# EasyEDA Pro project ProPrj_智能警报器(2)_2025-03-04_22-10-02_2025-04-03.epro, schematic Check

## Sheets
1 模块与接口: Board Name: 检测装置; Create Date: 2025-03-04; Page Name: 模块与接口; Project Name: 智能警报器_2025-03-04_22-10-02; Schematic Name: Check; Update Date: 2025-04-04; Company: 嘉立创EDA; Page Size: A4; Version: V1.0
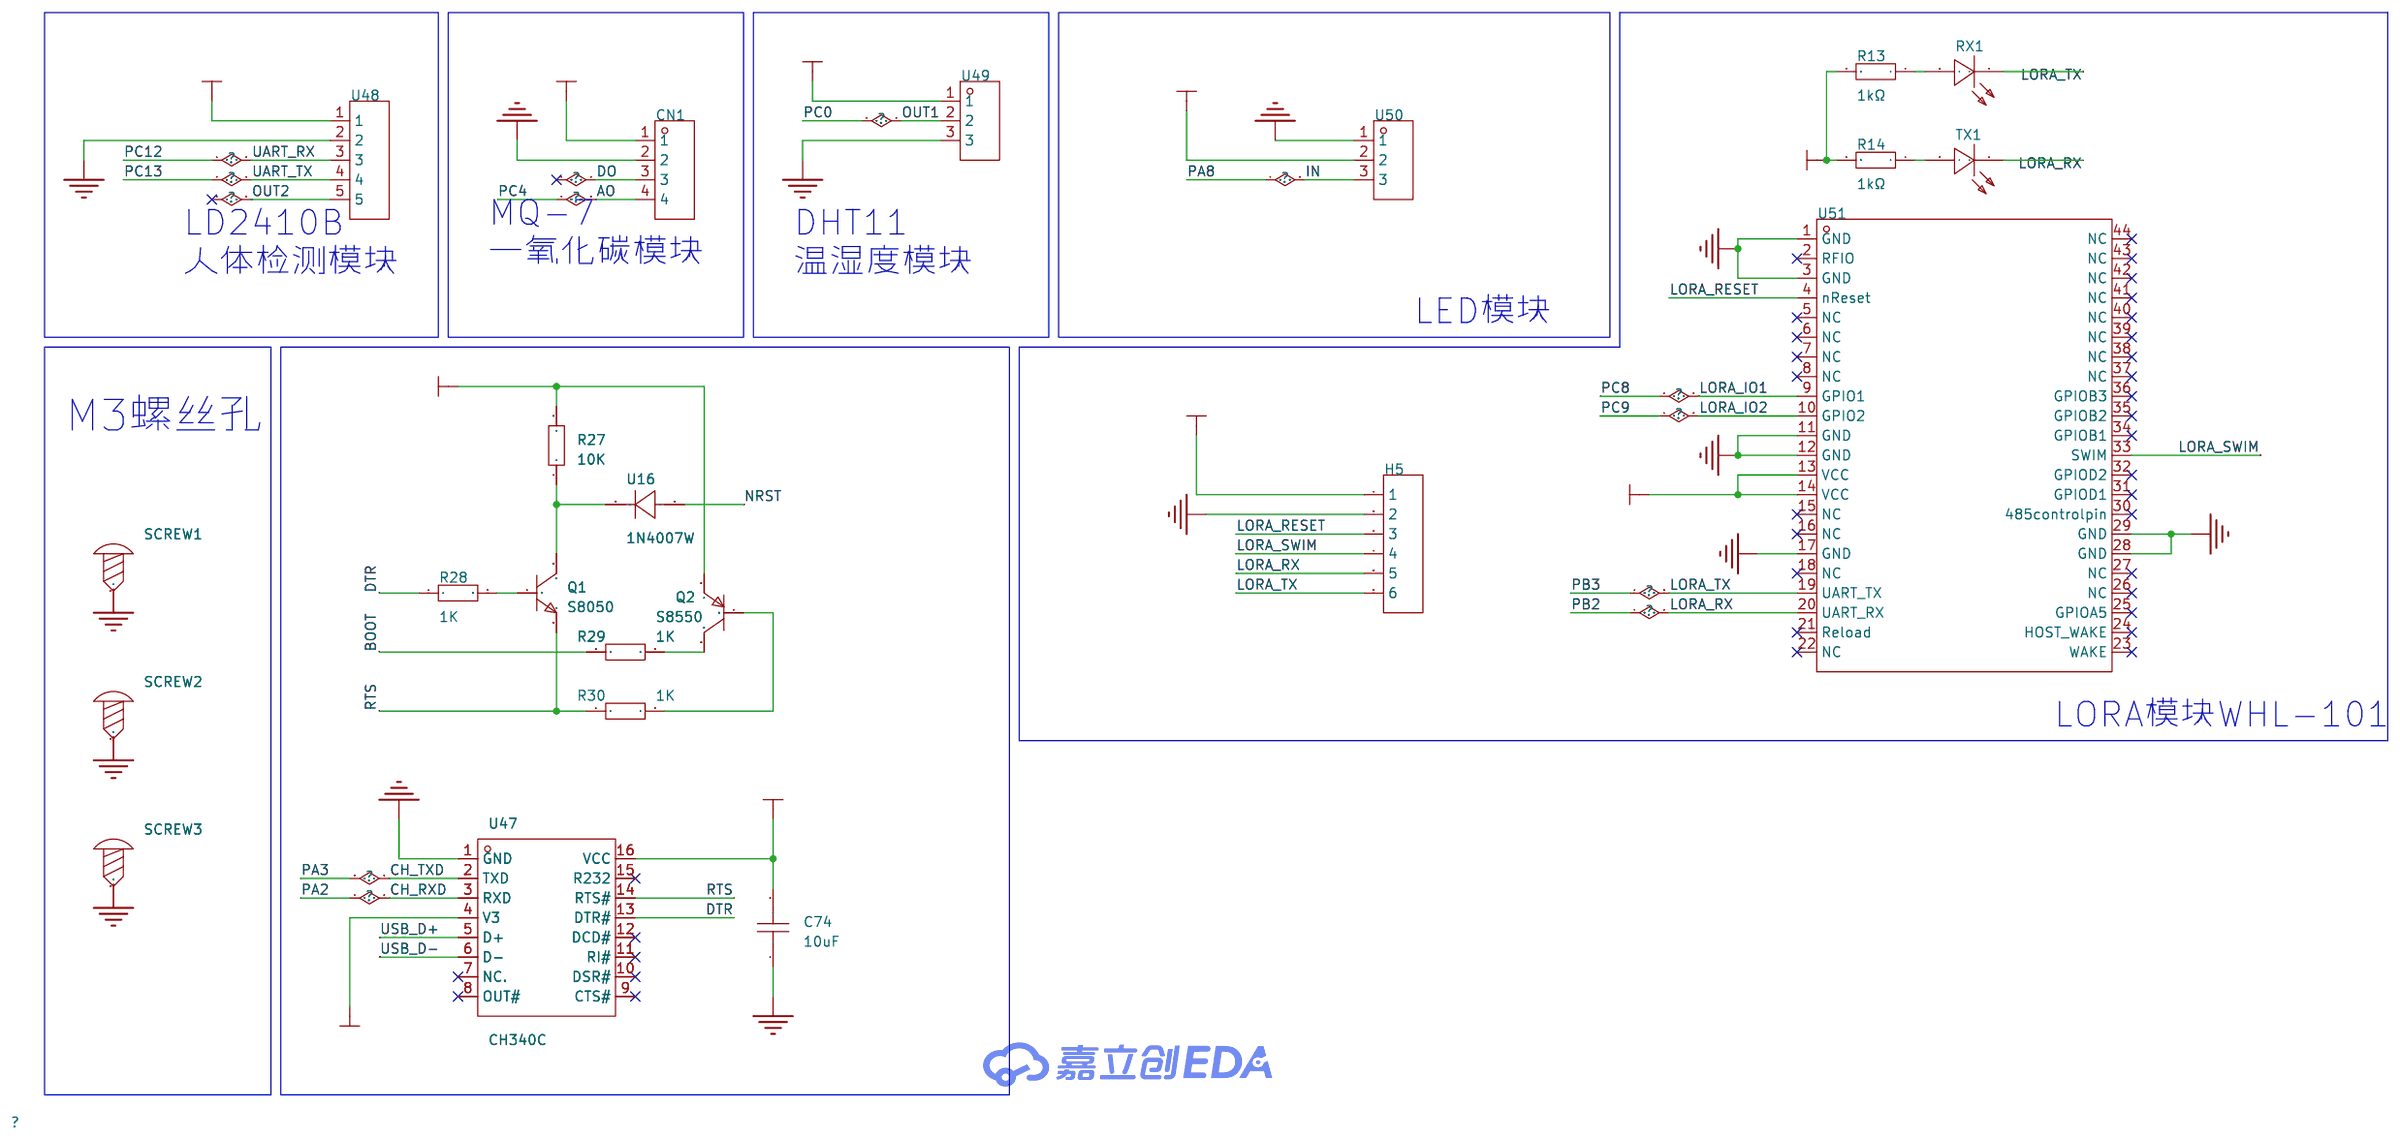
[diagram p6: 模块与接口]
2 电源: Create Date: 2025-03-11; Page Name: 电源; Schematic Name: Schematic1; Update Date: 2025-04-03
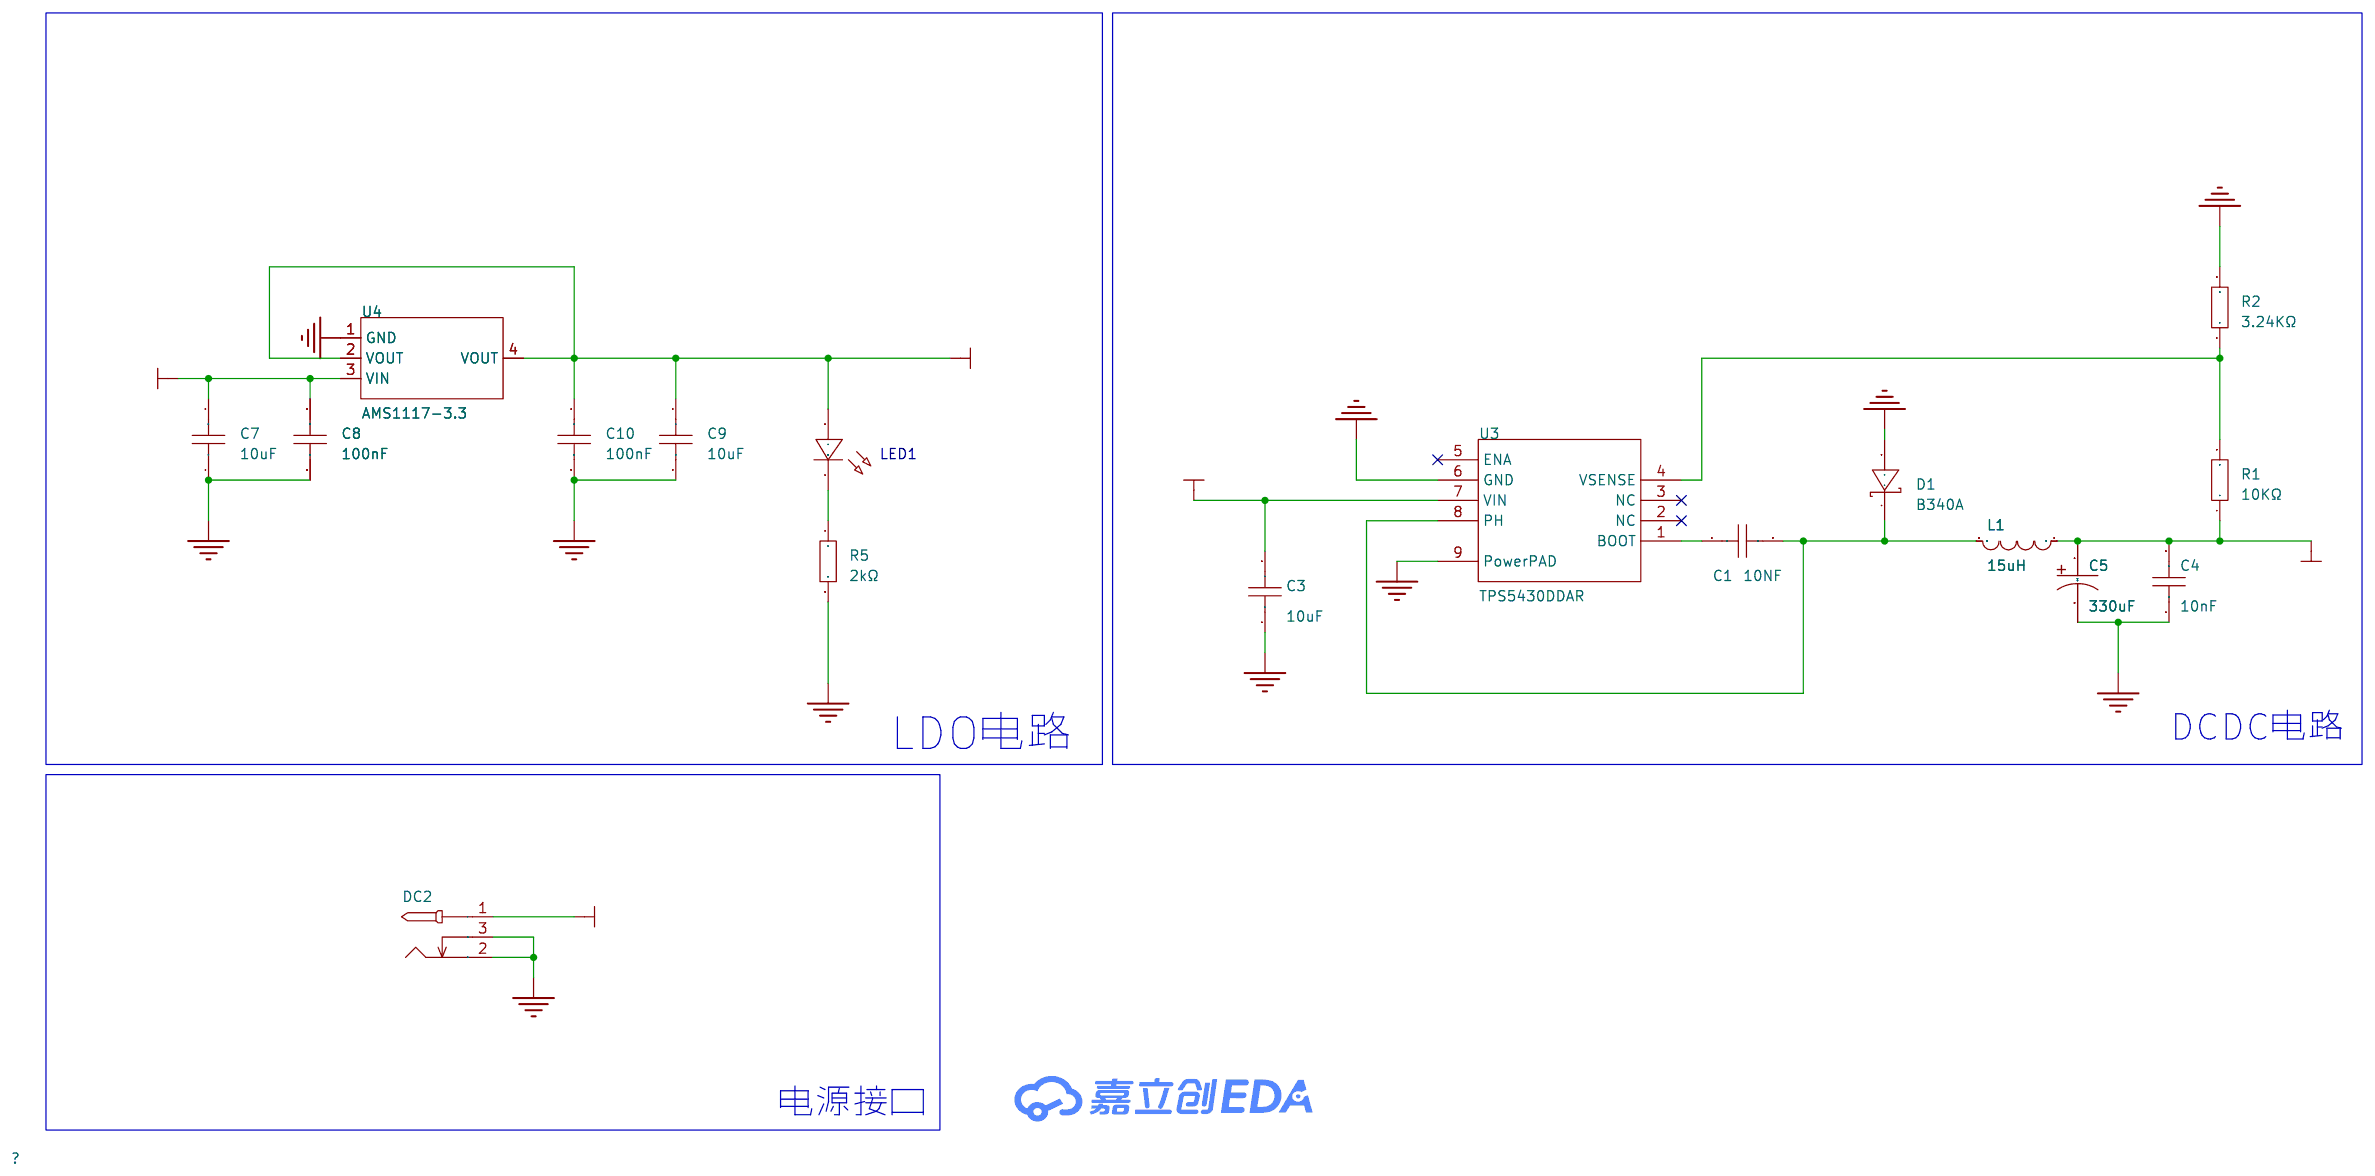
[diagram p7: 电源]
3 主控: Create Date: 2025-03-23; Page Name: 主控
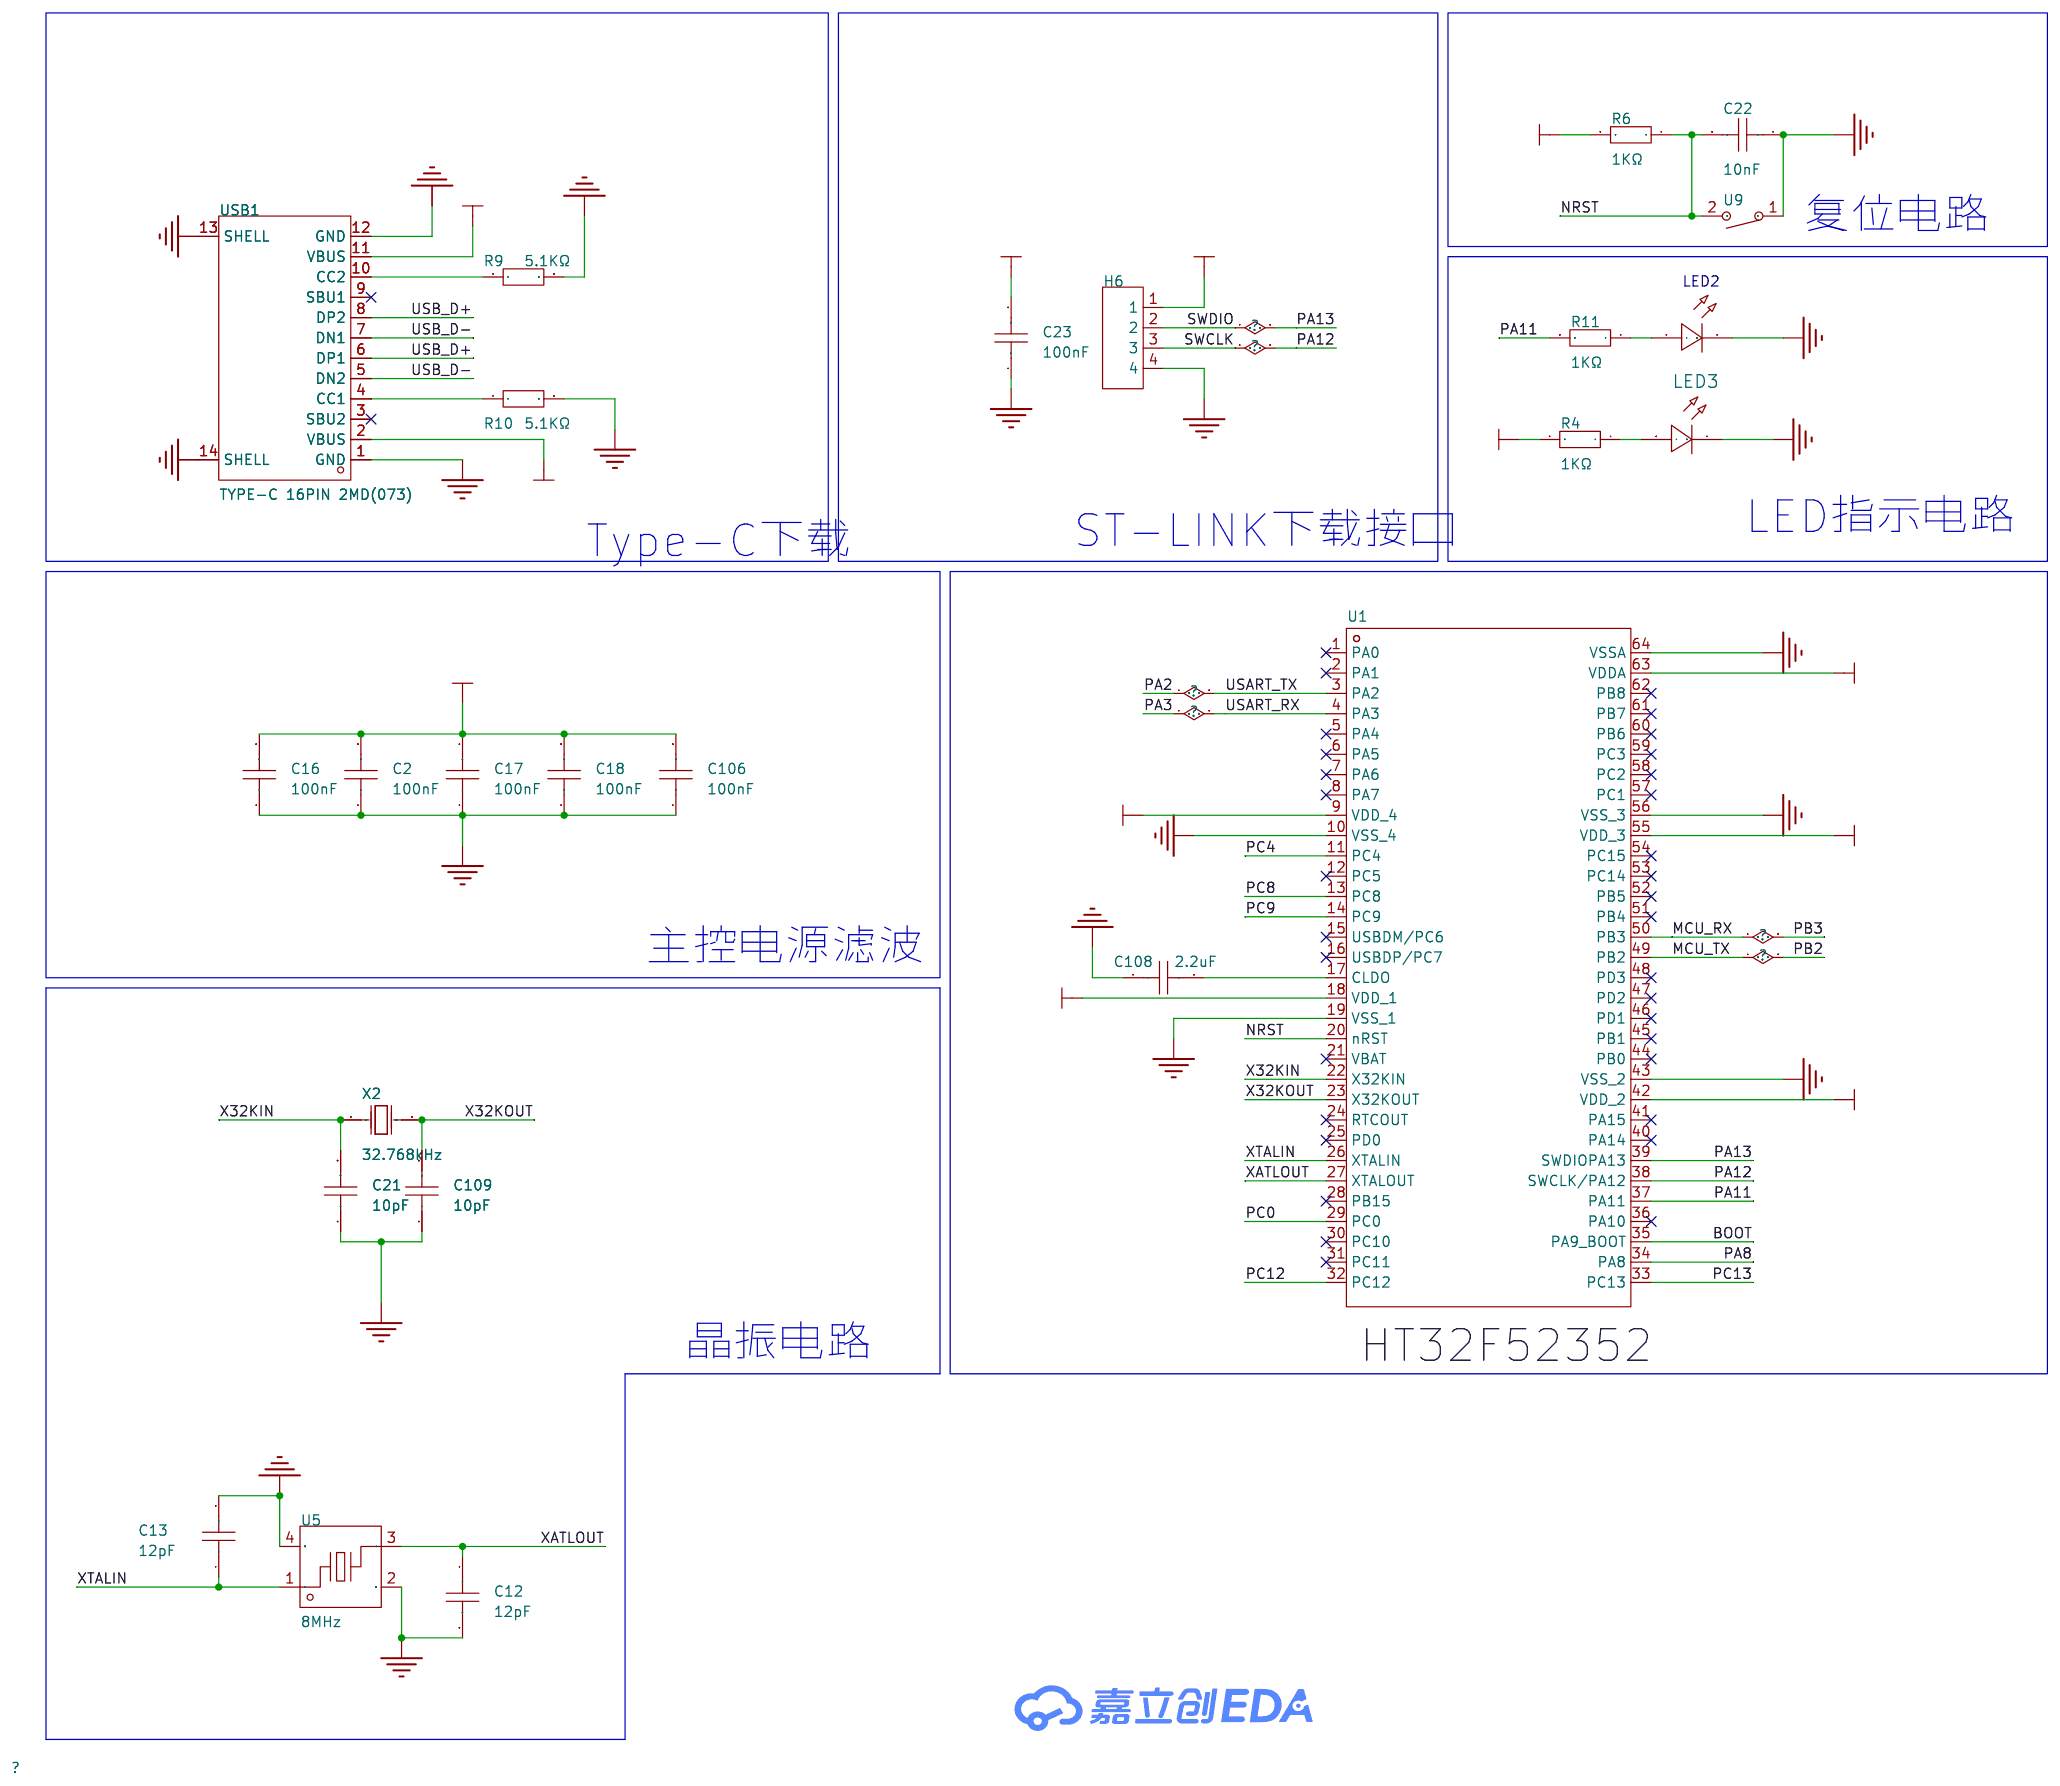
[diagram p8: 主控]

## Parts
sheet 主控
C2  100nF  [C0603]
C12  12pF  [C0603]
C13  12pF  [C0603]
C16  100nF  [C0603]
C17  100nF  [C0603]
C18  100nF  [C0603]
C21  10pF  [C0603]
C22  10nF  [C0603]
C23  100nF  [C0603]
C106  100nF  [C0603]
C108  2.2uF  [C0603]
C109  10pF  [C0603]
H6  -  [HDR-TH_4P-P2.54-V-M]
LED2  -  [LED_0603]
LED3  -  [LED_0603]
R4  1KΩ  [R0603]
R6  1KΩ  [R0603]
R9  5.1KΩ  [R0603]
R10  5.1KΩ  [R0603]
R11  1KΩ  [R0603]
U1  HT32F52352  [LQFP-64_L7.0-W7.0-P0.40-LS9.2-BL]
U5  8MHz  [CRYSTAL-SMD_4P-L2.5-W2.0-BL]
U9  轻触开关/软触开关(无声)/贴片6*6*5  [SW-SMD_L6.0-W5.9-LS6.6]
USB1  TYPE-C 16PIN 2MD(073)  [USB-C-SMD_TYPE-C-6PIN-2MD-073]
X2  32.768kHz  [OSC-SMD_L3.2-W1.5]
sheet 模块与接口
C74  10uF  [C0603]
CN1  WAFER-XH254Z-4A  [CONN-TH_XH-4A]
H5  -  [HDR-TH_6P-P2.54-V-M-1]
Q1  S8050  [SOT-23-3_L2.9-W1.3-P1.90-LS2.4-BR]
Q2  S8550  [SOT-23-3_L2.9-W1.3-P1.90-LS2.4-BR]
R13  1kΩ  [R0603]
R14  1kΩ  [R0603]
R27  10K  [R0603]
R28  1K  [R0603]
R29  1K  [R0603]
R30  1K  [R0603]
RX1  KT-0603R  [LED0603-RD]
SCREW1  -  [M3螺丝]
SCREW2  -  [M3螺丝]
SCREW3  -  [M3螺丝]
TX1  KT-0603R  [LED0603-RD]
U16  1N4007W  [SOD-123FL_L2.7-W1.8-LS3.7-RD]
U47  CH340C  [SOP-16_L10.0-W3.9-P1.27-LS6.0-BL]
U48  WAFER-XH254Z-5A  [CONN-TH_5P-P2.50_WAFER-XH254Z-5A]
U49  WAFER-XH254Z-3A  [CONN-TH_XH-3A]
U50  WAFER-XH254Z-3A  [CONN-TH_XH-3A]
U51  WH-L101-L-C  [COMM-SMD_WH-L101-L-C]
sheet 电源
C1  10NF  [C0603]
C3  10uF  [C0603]
C4  10nF  [C0603]
C5  330uF  [CAP-SMD_BD5.0-L5.3-W5.3-FD]
C7  10uF  [C0603]
C8  100nF  [C0603]
C9  10uF  [C0603]
C10  100nF  [C0603]
D1  B340A  [SMA_L4.3-W2.6-LS5.1-RD]
DC2  -  [DC-005_2.5]
L1  15uH  [L0603]
LED1  -  [LED_0603]
R1  10KΩ  [R0603]
R2  3.24KΩ  [R0603]
R5  2kΩ  [R0603]
U3  TPS5430DDAR  [ESOP-8_L4.9-W3.9-P1.27-LS6.0-TL-EP]
U4  AMS1117-3.3  [SOT-223-3_L6.5-W3.4-P2.30-LS7.0-BR]

## Library data of the parts
C1-C4 C7-C10 C12 C13 C16-C18 C21-C23 C74 C106 C108 C109 = CAP_0603: Supplier Footprint: 0603
H6 = HDR-M_2.54_1x4P: Supplier Part: C492403; Supplier Footprint: 插件; JLCPCB Part Class: 扩展库
LED2 = LED_0603-B: Supplier Footprint: 0603
LED3 = LED_0603-R: Supplier Footprint: 0603
R4 R6 R9-R11 = Res_0201: Supplier Footprint: 0201
U1 = HT32F52352: CPU内核:CM0;程序存储容量:128KB;RAM总容量:16KB;GPIO端口数量:51;工作电压范围:2V~3.6V;CPU最大主频:48MHz;程序存储器类型:FLASH;; Supplier Part: C97188; Manufacturer: HOLTEK(合泰/盛群); Supplier Footprint: LQFP-64(7x7); JLCPCB Part Class: 扩展库; Datasheet: https://atta.szlcsc.com/upload/public/pdf/source/20231226/5DA994CBD2B5E793EB1549DB6E6CD66A.pdf; Supplier: LCSC; CPU Core: CM0; Program Storage Size: 128KB; RAM Size: 16KB; GPIO Ports Number: 51; Operating Voltage Range: 2V~3.6V; CPU Maximum Speed: 48MHz; Program Memory Type: FLASH; Operating Temperature Range: -40℃~+85℃; ADC (Bit): 12bit; 16Bit Timer: 5; 32Bit Timer: 2; UART/USART: 4; I2C: 2; I2S: 1; SPI: 2; Universal Serial Bus: 有; Internal Comparator: 有; Peripheral/Function: 低电压检测；看门狗；CCP捕获/比较；乘法器；IrDA；CRC校验；DMA；RTC实时时钟; Watchdog: 有; Real-Time Clock: 有; Infrared Data Association: 有; Low-Voltage Detect: 有; CCP Capture/Compare: 有; Direct Memory Access: 有; Internal Oscillator: 有
U5 = SX2B50.000F1010F30: 晶振类型:贴片晶振;频率:50MHz;常温频差:±10ppm;外接负载电容:10pF;频率稳定度(全温):±30ppm;; LCSC Part Name: 50MHz ±10ppm 10pF; Supplier Part: C7301998; Manufacturer: SCTF(星通时频); Supplier Footprint: SMD2520-4P; JLCPCB Part Class: 扩展库; Datasheet: https://atta.szlcsc.com/upload/public/pdf/source/20230613/6EDA3BD8336403B8AE72C3A173CC38D7.pdf; Supplier: LCSC; Crystal Type: 贴片晶振; Normal temperature Frequency Tolerance: ±10ppm; External load capacitor: 10pF; Frequency Stability(Full temperature range): ±30ppm; Equivalent Series Resistance (ESR): 40Ω; Operating Temperature: -40℃~+85℃
U9 = 轻触开关/软触开关(无声)/贴片6*6*5_C9900014294: Supplier Part: C9900014294; JLCPCB Part Class: 扩展库; Supplier: LCSC
USB1 = TYPE-C 16PIN 2MD(073): 连接器类型:Type-C;标准:-;公母:母;端口数量:1;触点数量:16P;安装方式:卧贴;额定电流 - 电源:5A;工作温度范围:-25℃~+85℃;; LCSC Part Name: Type-C 母 卧贴; Supplier Part: C2765186; Manufacturer: SHOU HAN(首韩); Supplier Footprint: SMD; Datasheet: https://atta.szlcsc.com/upload/public/pdf/source/20211123/39B17C16241EAC15C5E277BDA434118E.pdf; Supplier: LCSC; Connector Type: Type-C; Gender: 母; Number of Ports: 1; Number of Contacts: 16P; Mounting Style: 卧贴; Current Rating - Power (Max): 5A; Operating Temperature Range: -25℃~+85℃
X2 = SF32WK32768D31T002: 晶振类型:-;频率:-;外接负载电容:-;; LCSC Part Name: 3215  32.768KHZ  12.5PF  ±20PPM  -40℃~+85℃; Supplier Part: C271654; Manufacturer: TKD(泰晶); Supplier Footprint: SMD3215-2P; JLCPCB Part Class: 扩展库; Datasheet: https://atta.szlcsc.com/upload/public/pdf/source/20210414/C271654_9FD726E46D0A9E6DACC0E569C8E3A63B.pdf; Supplier: LCSC
CN1 = WAFER-XH254Z-4A: 插针结构:1x4P;间距:2.54mm;安装方式:直插;参考系列:XH;总PIN数:4P;排数:1;每排PIN数:4;额定电流:3A;工作温度范围:-25℃~+85℃;; Supplier Part: C7432684; Manufacturer: HANBO(汉博); Supplier Footprint: 插件,P=2.5mm; JLCPCB Part Class: 扩展库; Datasheet: https://atta.szlcsc.com/upload/public/pdf/source/20230718/3B4FABA5D38EFB02DAF74E7C2B33D98F.pdf; Supplier: LCSC; Pins Structure: 1x4P; Pitch: 2.54mm; Mounting Style: 直插; Reference Series: XH; Number of Pins: 4P; Number of Rows: 1; Number of PINs Per Row: 4; Current Rating (Max): 3A; Operating Temperature Range: -25℃~+85℃
H5 = HDR-M_2.54_1x6P: Supplier Part: C37208; Supplier Footprint: 插件; JLCPCB Part Class: 扩展库
Q1 = S8050: NPN 25V 500mA 120-400 SOT-23; Supplier Part: C2931719; Manufacturer: Doeshare(德芯); Supplier Footprint: SOT-23; JLCPCB Part Class: 扩展库; Datasheet: https://atta.szlcsc.com/upload/public/pdf/source/20220117/E6D3315E0D6ADDB25840BFFAC039C5C0.pdf; Supplier: LCSC
Q2 = S8550: LCSC Part Name: PNP -25V -500mA 120-400 SOT-23; Supplier Part: C2931720; Manufacturer: Doeshare(德芯); Supplier Footprint: SOT-23; JLCPCB Part Class: 扩展库; Datasheet: https://atta.szlcsc.com/upload/public/pdf/source/20220104/15A23F6542E365B9E2BA018BE45092B6.pdf; Supplier: LCSC
R13 R14 = RC0603FR-071KL: 电阻类型:厚膜电阻;阻值:1kΩ;精度:±1%;功率:100mW;最大工作电压:75V;温度系数:±100ppm/℃;; LCSC Part Name: 厚膜电阻 1kΩ ±1% 100mW; Supplier Part: C22548; Manufacturer: YAGEO(国巨); Supplier Footprint: 0603; JLCPCB Part Class: Extended Part; Datasheet: https://atta.szlcsc.com/upload/public/pdf/source/20180316/70C0E2BDAE7FCC62C531A5A58D202EE1.pdf; Supplier: LCSC; Type: 厚膜电阻; Tolerance: ±1%; Power(Watts): 100mW; Temperature Coefficient: ±100ppm/℃; Overload Voltage (Max): 75V; Operating Temperature Range: -55℃~+155℃
R1 R2 R5 R27-R30 = Res_0603: Supplier Footprint: 0603
RX1 TX1 = KT-0603R: 发光颜色:红色;功率:-;正向电流:-;主波长:-;二极管配置:-;透镜颜色:-;色温:-;发光角度:-;载带方式:-;工作温度:-40℃~+85℃;; LCSC Part Name: 0603 红灯 高亮; Supplier Part: C2286; Manufacturer: KENTO; Supplier Footprint: 0603; JLCPCB Part Class: 基础库; Datasheet: https://atta.szlcsc.com/upload/public/pdf/source/20160616/1466072038404.pdf; Supplier: LCSC; Emitted Color: 红色; Operating Temperature: -40℃~+85℃
SCREW1-SCREW3 = M3螺丝: Supplier Footprint: 插件
U16 = 1N4007W_C7528871: 二极管配置:独立式;正向压降(Vf):1.1V@1A;直流反向耐压(Vr):1kV;整流电流:1A;; LCSC Part Name: 电压:1kV 电流:1A; Supplier Part: C7528871; Manufacturer: MSKSEMI(美森科); Supplier Footprint: SOD-123FL; JLCPCB Part Class: 扩展库; Datasheet: https://atta.szlcsc.com/upload/public/pdf/source/20230821/E9E7B8A13216AEAB33D679873610DFE6.pdf; Supplier: LCSC; Diode Configuration: 独立式; Forward Voltage (Vf@If): 1.1V@1A; Reverse Voltage (Vr): 1kV; Rectified Current: 1A
U47 = CH340C: 应用功能:收发器;接口协议:USB 2.0;数据速率:2Mbps;; LCSC Part Name: CH340C USB转串口芯片 CH340; Supplier Part: C84681; Manufacturer: WCH(南京沁恒); Supplier Footprint: SOP-16; Datasheet: https://atta.szlcsc.com/upload/public/pdf/source/20240619/63986D8440D4E5267A77ACD891CC4DE3.pdf; Supplier: LCSC; Applications Function: 收发器; Protocol: USB 2.0; Supply Voltage: 3.3V；5V; Data Rate: 2Mbps
U48 = WAFER-XH254Z-5A: 插针结构:1x5P;间距:2.54mm;安装方式:直插;参考系列:XH;总PIN数:5P;排数:1;每排PIN数:5;额定电流:3A;工作温度:-25℃~+85℃;; Supplier Part: C7432685; Manufacturer: HANBO(汉博); Supplier Footprint: 插件,P=2.5mm; JLCPCB Part Class: 扩展库; Datasheet: https://atta.szlcsc.com/upload/public/pdf/source/20230718/3B4FABA5D38EFB02DAF74E7C2B33D98F.pdf; Supplier: LCSC; Pins Structure: 1x5P; Pitch: 2.54mm; Mounting Type: 直插; Reference Series: XH; Number of Pins: 5P; Number of Rows: 1; Number of PINs Per Row: 5; Current Rating: 3A; Operating Temperature: -25℃~+85℃
U49 U50 = WAFER-XH254Z-3A: 插针结构:1x3P;间距:2.54mm;安装方式:直插;参考系列:XH;总PIN数:3P;排数:1;每排PIN数:3;额定电流:3A;工作温度范围:-25℃~+85℃;; Supplier Part: C7432683; Manufacturer: HANBO(汉博); Supplier Footprint: 插件,P=2.5mm; JLCPCB Part Class: 扩展库; Datasheet: https://atta.szlcsc.com/upload/public/pdf/source/20230718/3B4FABA5D38EFB02DAF74E7C2B33D98F.pdf; Supplier: LCSC; Pins Structure: 1x3P; Pitch: 2.54mm; Mounting Style: 直插; Reference Series: XH; Number of Pins: 3P; Number of Rows: 1; Number of PINs Per Row: 3; Current Rating (Max): 3A; Operating Temperature Range: -25℃~+85℃
U51 = WH-L101-L-C: Supplier Part: C2839188; Manufacturer: USR(有人物联网); Supplier Footprint: SMD,18.2x26.7mm; JLCPCB Part Class: 扩展库; Datasheet: https://atta.szlcsc.com/upload/public/pdf/source/20210707/C2839188_8B9CF052393124210560C9EDFDE3EF54.pdf; Supplier: LCSC
C5 = EMVE500ADA4R7ME55G: 容值:4.7uF;精度:±20%;额定电压:50V;纹波电流:20mA@120Hz;等效串联电阻:-;; LCSC Part Name: 4.7uF ±20% 50V; Supplier Part: C178270; Manufacturer: NCC(日本贵弥功); Supplier Footprint: SMD,D5xL5.2mm; JLCPCB Part Class: 扩展库; Datasheet: https://atta.szlcsc.com/upload/public/pdf/source/20180530/C178280_3EF6968EAC9B0F0D2B2AB76FB03ACC1C.pdf; Supplier: LCSC; Tolerance: ±20%; Rated Voltage: 50V; Ripple Current: 20mA@120Hz; φD: 5mm; L: 5.2mm; Lifetime @ Temp: 1000hrs@105℃; Operating Temperature: -40℃~+105℃
D1 = B340A: 二极管配置:独立式;正向压降(Vf):550mV@3A;直流反向耐压(Vr):40V;整流电流:3A;; LCSC Part Name: 电压:40V 电流:3A; Supplier Part: C64982; Manufacturer: MDD(辰达半导体); Supplier Footprint: SMA(DO-214AC); JLCPCB Part Class: 扩展库; Datasheet: https://atta.szlcsc.com/upload/public/pdf/source/20240710/591710C3B34CDB7FE3DA92C119E6F598.pdf; Supplier: LCSC; Diode Configuration: 独立式; Forward Voltage (Vf@If): 550mV@3A; Reverse Voltage (Vr): 40V; Rectified Current: 3A; Reverse Leakage Current (Ir): 500uA@40V
DC2 = DC-005_2.5: Supplier Footprint: 插件
L1 = L_0603
LED1 = LED_0603-G: Supplier Footprint: 0603
U3 = TPS5430DDAR: 功能类型:降压型;输出类型:可调;工作电压:5.5V~36V;输出电压:1.221V~32.04V;输出电流:3A;; LCSC Part Name: 宽输入范围、3A输出电流的降压转换器; Supplier Part: C9864; Manufacturer: TI(德州仪器); Supplier Footprint: SOIC-8-EP; JLCPCB Part Class: 基础库; Datasheet: https://www.ti.com/cn/lit/gpn/tps5430; Supplier: LCSC; Function: 降压型; Output Type: 可调; Input Voltage: 5.5V~36V; Output Voltage: 1.221V~32.04V; Output Current: 3A; Switching Frequency: 500kHz; Operating Temperature: -40℃~+125℃@(TJ); Synchronous Rectification: 否; Number of Outputs: 1; Topology: 降压式; Switch tube (built-in/external): 内置
U4 = AMS1117-3.3_C6186: 输出类型:固定;工作电压:-;输出电压:3.3V;输出电流:1A;电源纹波抑制比(PSRR):72dB@(120Hz);输出极性:正极;; LCSC Part Name: 输出3.3V 1A; Supplier Part: C6186; Manufacturer: AMS; Supplier Footprint: SOT-223; JLCPCB Part Class: 基础库; Datasheet: https://atta.szlcsc.com/upload/public/pdf/source/20180727/C6186_7A095716F0823C02F1997A905E26C086.pdf; Supplier: LCSC; Output Type: 固定; Output Voltage: 3.3V; Output Current: 1A; Power Supply Rejection Ratio (PSRR): 72dB@(120Hz); Voltage Dropout: 1.3V@(800mA); Features: 过流保护(OCP)；热关断(TSD); Output Configuration: 正极; Number of Outputs: 1

## Nets
GND: C2.1 C3.1 C4.1 C5.2 C7.1 C8.1 C9.2 C10.2 C12.2 C13.2 C16.1 C17.1 C18.1 C21.1 C22.1 C23.1 C74.1 C106.1 C108.1 C109.1 CN1.2 D1.2(A) DC2.2 DC2.3 H5.2 H6.4 LED2.1(C) LED3.1(C) R2.2 R5.2 R9.2 R10.2 SCREW1.1 SCREW2.1 SCREW3.1 U1.10(VSS_4) U1.19(VSS_1) U1.43(VSS_2) U1.56(VSS_3) U1.64(VSSA) U3.6(GND) U3.9(PowerPAD) U4.1(GND) U5.2(GND) U5.4(GND) U9.1 U47.1(GND) U48.2 U49.3 U50.1 U51.1(GND) U51.3(GND) U51.11(GND) U51.12(GND) U51.17(GND) U51.28(GND) U51.29(GND) USB1.1(GND) USB1.12(GND) USB1.13(SHELL) USB1.14(SHELL)
VCC+3.3V: C2.2 C9.1 C10.1 C16.2 C17.2 C18.2 C23.2 C74.2 C106.2 H5.1 H6.1 LED1.2(A) Q2.2(E) R4.2 R6.2 R13.2 R14.2 R27.2 U1.9(VDD_4) U1.18(VDD_1) U1.42(VDD_2) U1.55(VDD_3) U1.63(VDDA) U4.2(VOUT) U4.4(VOUT) U47.4(V3) U47.16(VCC) U49.1 U50.2 U51.13(VCC) U51.14(VCC)
VCC+5V: C4.2 C5.1 C7.2 C8.2 CN1.1 L1.1 R1.1 U4.3(VIN) U48.1 USB1.2(VBUS) USB1.11(VBUS)
VCC_IN: C3.2 DC2.1(4) U3.7(VIN)
AO: CN1.4 U1.11(PC4)
BOOT: R29.1 U1.35(PA9_BOOT)
CH_RXD: U1.3(PA2) U47.3(RXD)
CH_TXD: U1.4(PA3) U47.2(TXD)
DO: CN1.3
DTR: R28.1 U47.13(DTR#)
IN: U1.34(PA8) U50.3
LORA_IO1: U1.13(PC8) U51.9(GPIO1)
LORA_IO2: U1.14(PC9) U51.10(GPIO2)
LORA_RESET: H5.3 U51.4(nReset)
LORA_RX: H5.5 TX1.1(K) U1.49(PB2) U51.20(UART_RX)
LORA_SWIM: H5.4 U51.33(SWIM)
LORA_TX: H5.6 RX1.1(K) U1.50(PB3) U51.19(UART_TX)
NRST: C22.2 R6.1 U1.20(nRST) U9.2 U16.2(A)
OUT1: U1.29(PC0) U49.2
OUT2: U48.5
PA11: R11.2 U1.37(PA11)
PA12: H6.3 U1.38(SWCLK/PA12)
PA13: H6.2 U1.39(SWDIOPA13)
PC12: U1.32(PC12) U48.3
PC13: U1.33(PC13) U48.4
RTS: Q1.2(E) R30.1 U47.14(RTS#)
USB_D+: U47.5(D+) USB1.6(DP1) USB1.8(DP2)
USB_D-: U47.6(D-) USB1.5(DN2) USB1.7(DN1)
X32KIN: C21.2 U1.22(X32KIN) X2.1(OSC1)
X32KOUT: C109.2 U1.23(X32KOUT) X2.2(OSC2)
XATLOUT: C12.1 U1.27(XTALOUT) U5.3
XTALIN: C13.1 U1.26(XTALIN) U5.1
$1N6895: Q2.1(B) R30.2
$1N6912: Q2.3(C) R29.2
$1N6913: Q1.1(B) R28.2
$1N6917: Q1.3(C) R27.1 U16.1(K)
$1N9078: R14.1 TX1.2(A)
$1N9093: R13.1 RX1.2(A)
$2N414: C1.2 D1.1(K) L1.2 U3.8(PH)
$2N415: C1.1 U3.1(BOOT)
$2N416: R1.2 R2.1 U3.4(VSENSE)
$2N4500: LED1.1(C) R5.1
$3N3726: LED3.2(A) R4.1
$3N3729: LED2.2(A) R11.1
$3N8921: C108.2 U1.17(CLDO)
$3N14908: R9.1 USB1.10(CC2)
$3N14923: R10.1 USB1.4(CC1)

Not connected (* = marked no-connect by the designer): U1 1(PA0)* 2(PA1)* 5(PA4)* 6(PA5)* 7(PA6)* 8(PA7)* 12(PC5)* 15(USBDM/PC6)* 16(USBDP/PC7)* 21(VBAT)* 24(RTCOUT)* 25(PD0)* 28(PB15)* 30(PC10)* 31(PC11)* 36(PA10)* 40(PA14)* 41(PA15)* 44(PB0)* 45(PB1)* 46(PD1)* 47(PD2)* 48(PD3)* 51(PB4)* 52(PB5)* 53(PC14)* 54(PC15)* 57(PC1)* 58(PC2)* 59(PC3)* 60(PB6)* 61(PB7)* 62(PB8)*; U3 2(NC)* 3(NC)* 5(ENA)*; U47 7(NC.)* 8(OUT#)* 9(CTS#)* 10(DSR#)* 11(RI#)* 12(DCD#)* 15(R232)*; U51 2(RFIO)* 5(NC)* 6(NC)* 7(NC)* 8(NC)* 15(NC)* 16(NC)* 18(NC)* 21(Reload)* 22(NC)* 23(WAKE)* 24(HOST_WAKE)* 25(GPIOA5)* 26(NC)* 27(NC)* 30(485controlpin)* 31(GPIOD1)* 32(GPIOD2)* 34(GPIOB1)* 35(GPIOB2)* 36(GPIOB3)* 37(NC)* 38(NC)* 39(NC)* 40(NC)* 41(NC)* 42(NC)* 43(NC)* 44(NC)*; USB1 3(SBU2)* 9(SBU1)*

## Notes on the sheets
sheet 1
- LD2410B
  人体检测模块
- MQ-7
  一氧化碳模块
- DHT11
  温湿度模块
- LED模块
- M3螺丝孔
- LORA模块WHL-101
sheet 2
- DCDC电路
- LDO电路
- 电源接口
sheet 3
- 复位电路
- LED指示电路
- ST-LINK下载接口
- Type-C下载
- 主控电源滤波
- 晶振电路
